# Altium schematic sheet SD.SchDoc
size A
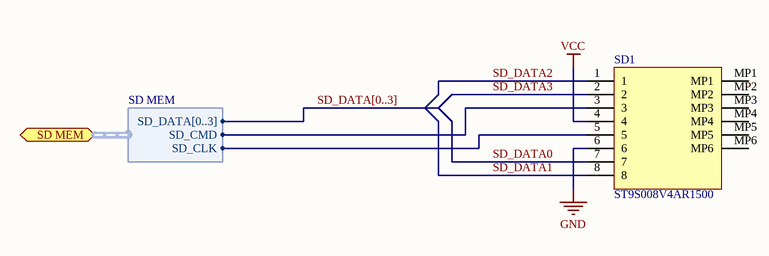
[diagram p0: SD.SchDoc]

## Parts
SD1  ST9S008V4AR1500  [JAE-ST9S008V4AR1500_V]

## Ports
SD MEM (harness SD MEM)

## Harnesses
SD MEM: SD_CLK, SD_CMD, SD_DATA[0..3]

## Nets
GND: SD1.6
VCC: SD1.4
SD_DATA0: SD1.7
SD_DATA1: SD1.8
SD_DATA2: SD1.1
SD_DATA3: SD1.2
NetSD1_3: SD1.3 ; port SD MEM.SD_CMD
NetSD1_5: SD1.5 ; port SD MEM.SD_CLK

Not connected (* = marked no-connect by the designer): SD1 MP1 MP2 MP3 MP4 MP5 MP6

## Buses and harness runs
bus SD_DATA[0..3]

## Library data of the parts
SD1 = CMP-1754-00001-1: Micro SD Memory Card Connector, -25 to 85 degC, 8-Pin SMD, RoHS, Tape and Reel; Shielding: Unshielded; Case\Package: 0402; Current Rating: 400 mA; Tolerance: 5%; Min Operating Temperature: -20 degC; ComponentLink3URL: https://datasheet.ciiva.com/683/sj108062-683405.pdf; Width: 0.5 mm; Mount: Surface Mount; RoHSCompliant: true; ComponentLink2URL: http://jae-connector.com/en/pdf/MB-0177-1E_ST9.pdf; Radiation Hardening: No; Case Code (Imperial): 0402; PackageVersion: Rev. 2, 12/2007; Height: 0.5 mm; Length: 1 mm; Max Operating Temperature: 85 degC; PackageReference: ST9S008V4AR1500; Packaging: Tape and Reel; DatasheetVersion: Dec-08; Weight: 2.8E-05 oz; Package Quantity: 10000; ComponentLink1URL: http://www.jaeusa.com/; Case Code (Metric): 1005; ComponentLink3Description: Package Specification; ComponentLink1Description: Manufacturer URL; ComponentLink2Description: Datasheet; PackageDescription: 8-Pin Surface Mount Device, Body 15.2 x 13.7 mm, Pitch 1.1 mm